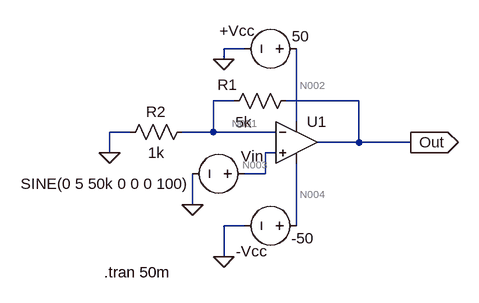
[diagram p0: schematic Noninverting Amplifier.asc]
Noninverting Amplifier.asc, the LTspice schematic file:
Version 4
SHEET 1 880 680
WIRE 96 48 64 48
WIRE 64 64 64 48
WIRE 80 128 48 128
WIRE 272 128 160 128
WIRE 176 160 176 48
WIRE -80 176 -112 176
WIRE 48 176 48 128
WIRE 48 176 0 176
WIRE 144 176 48 176
WIRE 272 192 272 128
WIRE 272 192 208 192
WIRE 352 192 272 192
WIRE -112 208 -112 176
WIRE 144 208 128 208
WIRE 128 240 128 208
WIRE 128 240 96 240
WIRE 16 288 16 240
WIRE 96 320 64 320
WIRE 176 320 176 224
WIRE 64 368 64 320
FLAG 352 192 Out
IOPIN 352 192 Out
FLAG -112 208 0
FLAG 64 368 0
FLAG 64 64 0
FLAG 16 288 0
SYMBOL Opamps\\UniversalOpamp2 176 192 R0
SYMATTR InstName U1
SYMBOL voltage 192 48 R90
WINDOW 0 -12 108 VBottom 2
WINDOW 3 -35 10 VTop 2
WINDOW 123 0 0 Left 2
WINDOW 39 0 0 Left 2
SYMATTR InstName +Vcc
SYMATTR Value 50
SYMBOL voltage 192 320 R90
WINDOW 0 55 85 VBottom 2
WINDOW 3 4 6 VTop 2
WINDOW 123 0 0 Left 2
WINDOW 39 0 0 Left 2
SYMATTR InstName -Vcc
SYMATTR Value -50
SYMBOL res 64 144 R270
WINDOW 0 25 6 VTop 2
WINDOW 3 -1 31 VBottom 2
SYMATTR InstName R1
SYMATTR Value 5k
SYMBOL res 16 160 R90
WINDOW 0 0 56 VBottom 2
WINDOW 3 32 56 VTop 2
SYMATTR InstName R2
SYMATTR Value 1k
SYMBOL voltage 112 240 R90
WINDOW 0 -11 4 VBottom 2
WINDOW 3 0 231 VTop 2
WINDOW 123 0 0 Left 2
WINDOW 39 0 0 Left 2
SYMATTR InstName Vin
SYMATTR Value SINE(0 5 50k 0 0 0 100)
TEXT -120 392 Left 2 !.tran 50m

The netlist it stands for:
* Noninverting Amplifier.asc
XU1 N003 N001 N002 N004 Out level.2 Avol=1Meg GBW=10Meg Slew=10Meg ilimit=25m rail=0 Vos=0 phimargin=45 en=0 enk=0 in=0 ink=0 Rin=500Meg  ; pins IN+ IN- V+ V- OUT
V§+Vcc N002 0 50
V§-Vcc N004 0 -50
R1 N001 Out 5k
R2 N001 0 1k
Vin N003 0 SINE(0 5 50k 0 0 0 100)
.tran 50m
.lib UniversalOpamps2.sub
.backanno
.end

* Results of the author's LTspice run, read from the files saved beside the schematic
* Operating Point, zero values left out:
*   V(n002) = 50 V
*   V(n004) = -50 V
*   I(-vcc) = 4.935 mA
*   I(+vcc) = -4.935 mA
*   Ix(u1:3) = 4.935 mA
*   Ix(u1:4) = -4.935 mA
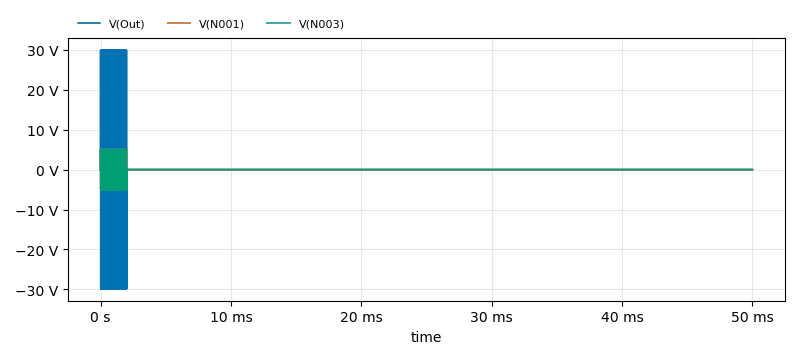
[diagram p1: Transient Analysis of Noninverting Amplifier.asc, plotted from the saved traces]
* Transient Analysis, 1 run:
*   V(Out): min -29.84 V, max 29.84 V, average -11.16 µV, rms 4.211 V, last 0 V
*   V(N001): min -4.973 V, max 4.973 V, average -1.859 µV, rms 701.8 mV, last 0 V
*   V(N003): min -4.982 V, max 4.982 V, average -1.361 µV, rms 703.1 mV, last 0 V